# EAGLE design ups-node (EAGLE 7.2.0)
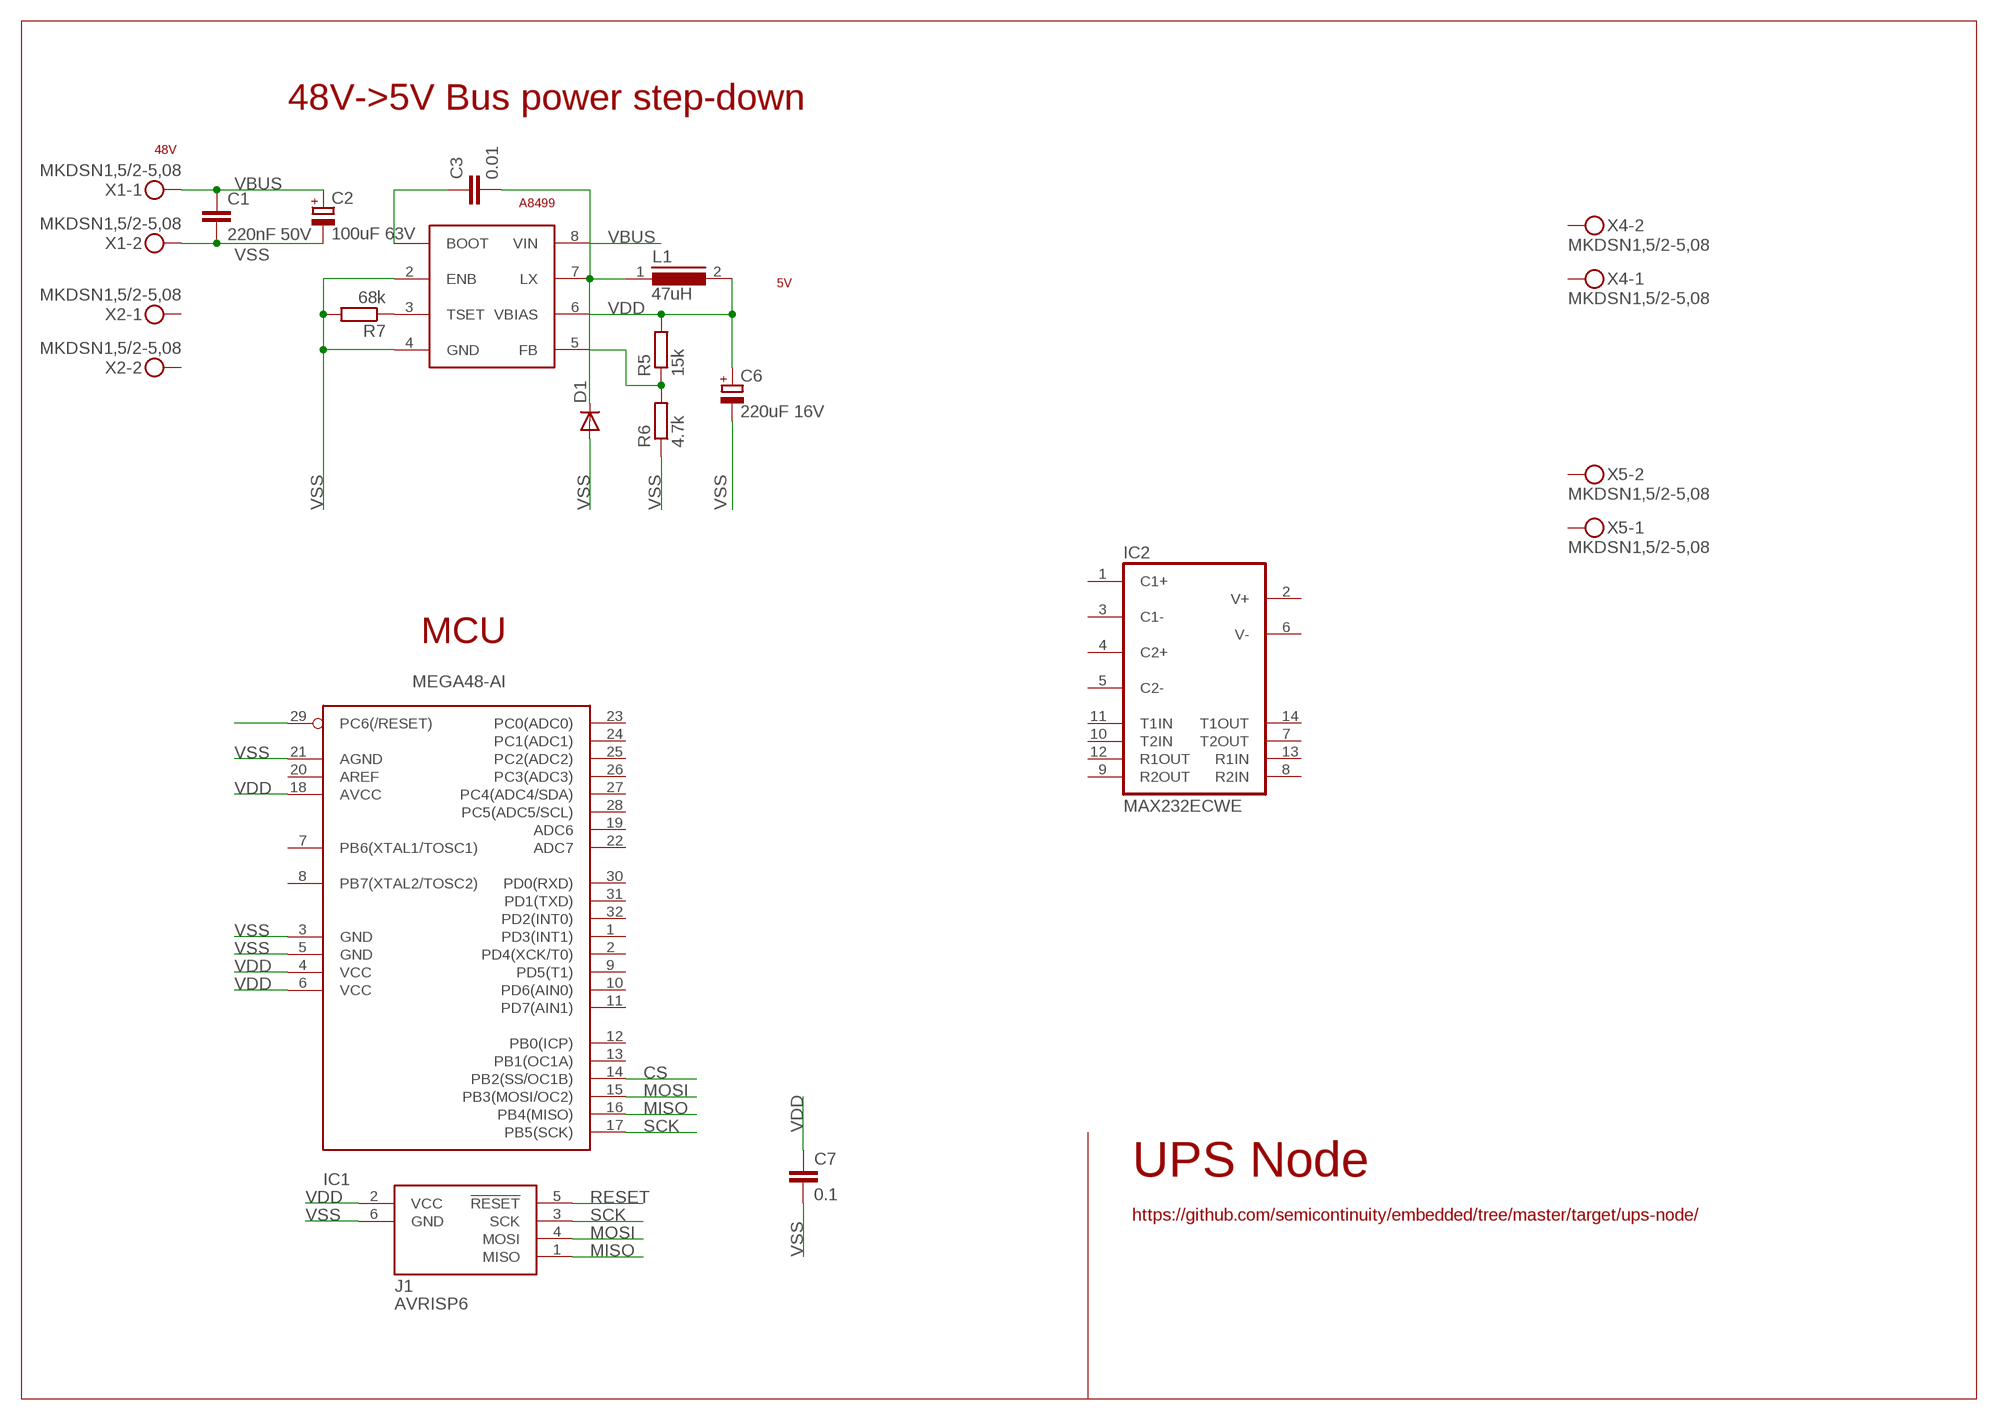
[diagram p0: schematic, sheet 1]

## Parts
C1  220nF 50V  C-EUC0805  [C0805]
C2  100uF 63V  CPOL-EU153CLV-1010  [153CLV-1010]
C3  0.01  C-EUC0805  [C0805]
C6  220uF 16V  CPOL-EU153CLV-0605  [153CLV-0605]
C7  0.1  C-EUC0805  [C0805]
D1  DIODE-SMB  [SMB]
IC1  MEGA48-AI  MEGA8-AI  [TQFP32-08]
IC2  MAX232ECWE  [SO16L]
J1  AVRISP6  [CON6P2R]
L1  47uH  DR127  [DR127]
R5  15k  R-EU_R0805  [R0805]
R6  4.7k  R-EU_R0805  [R0805]
R7  68k  R-EU_R0805  [R0805]
U$1  A8499  A8499SLJT  [SO08]
X1  MKDSN1,5/2-5,08  [MKDSN1,5/2-5,08]
X2  MKDSN1,5/2-5,08  [MKDSN1,5/2-5,08]
X4  MKDSN1,5/2-5,08  [MKDSN1,5/2-5,08]
X5  MKDSN1,5/2-5,08  [MKDSN1,5/2-5,08]

## Nets
BOOT: C3.1 U$1.1(BOOT)
CS: IC1.14(PB2(SS/OC1B))
LX: C3.2 D1.C L1.1 U$1.7(LX)
MISO: IC1.16(PB4(MISO)) J1.1(MISO)
MOSI: IC1.15(PB3(MOSI/OC2)) J1.4(MOSI)
N$14: R5.1 R6.2 U$1.5(FB)
N$15: R7.1 U$1.3(TSET)
RESET: IC1.29(PC6(/RESET)) J1.5(!RESET)
SCK: IC1.17(PB5(SCK)) J1.3(SCK)
VBUS: C1.1 C2.+ U$1.8(VIN) X1.1
VDD: C6.+ C7.1 IC1.4(VCC) IC1.6(VCC) IC1.18(AVCC) J1.2(VCC) L1.2 R5.2 U$1.6(VBIAS)
VSS: C1.2 C2.- C6.- C7.2 D1.A IC1.3(GND) IC1.5(GND) IC1.21(AGND) J1.6(GND) R6.1 R7.2 U$1.2(ENB) U$1.4(GND) X1.2
Unconnected: IC1.1(PD3(INT1)) IC1.2(PD4(XCK/T0)) IC1.7(PB6(XTAL1/TOSC1)) IC1.8(PB7(XTAL2/TOSC2)) IC1.9(PD5(T1)) IC1.10(PD6(AIN0)) IC1.11(PD7(AIN1)) IC1.12(PB0(ICP)) IC1.13(PB1(OC1A)) IC1.19(ADC6) IC1.20(AREF) IC1.22(ADC7) IC1.23(PC0(ADC0)) IC1.24(PC1(ADC1)) IC1.25(PC2(ADC2)) IC1.26(PC3(ADC3)) IC1.27(PC4(ADC4/SDA)) IC1.28(PC5(ADC5/SCL)) IC1.30(PD0(RXD)) IC1.31(PD1(TXD)) IC1.32(PD2(INT0)) IC2.1(C1+) IC2.2(V+) IC2.3(C1-) IC2.4(C2+) IC2.5(C2-) IC2.6(V-) IC2.7(T2OUT) IC2.8(R2IN) IC2.9(R2OUT) IC2.10(T2IN) IC2.11(T1IN) IC2.12(R1OUT) IC2.13(R1IN) IC2.14(T1OUT) X2.1 X2.2 X4.1 X4.2 X5.1 X5.2

## Notes on the sheet
- 48V->5V Bus power step-down
- 48V
- A8499
- 5V
- MCU
- UPS Node
- https://github.com/semicontinuity/embedded/tree/master/target/ups-node/

## Power pins joined to a net without a drawn wire
GND: IC2.15(GND)
VCC: IC2.16(VCC)

## Library data of the parts
C1 C3 C7 = rcl:C-EU: CAPACITOR, European symbol
C2 C6 = rcl:CPOL-EU: POLARIZED CAPACITOR, European symbol
D1 = diode:DIODE-: DIODE
IC1 = my-atmel:MEGA8: MICROCONTROLLER 8 Kbytes FLASH 1 kbytes SRAM 512 bytes EEPROM USART 6-channel 10 bit ADC 2-channel 8 bit ADC
IC2 = maxim:MAX232ECWE: RS232 TRANSCEIVER; MF: MAXIM; MPN: MAX232ECWE+; OC_FARNELL: 9724435; OC_NEWARK: 67K4440
J1 = ads4:AVRISP6: 6-pin dual-row connector for Atmel AVRISP programmer interface
L1 = inductors:DR127: High Power Density, High Efficiency, Shielded Inductors Source: coiltronics_dr_series.pdf
R5-R7 = rcl:R-EU_: RESISTOR, European symbol
U$1 = my-allegro:A8499SLJT: A8499SLJT Allegro Microsystems Step-Down regulator, 8V-50V, 1.5A, SO8
X1 X2 X4 X5 = con-phoenix-508:MKDSN1,5/2-5,08: MKDSN 1,5/ 2-5,08 Printklemme Nennstrom: 13,5 A Nennspannung: 250 V Rastermaß: 5,08 mm Polzahl: 2 Anschlussart: Schraubanschluss Montage: Löten Anschlussrichtung Leiter/Platine: 0 ° Artikelnummer: 1729128 Source: http://eshop.phoenixcontact.com .. 1729128.pdf; MPN: MKDSN 1,5/2-5.08; OC_FARNELL: 1792903; OC_NEWARK: 30M2397

## Board
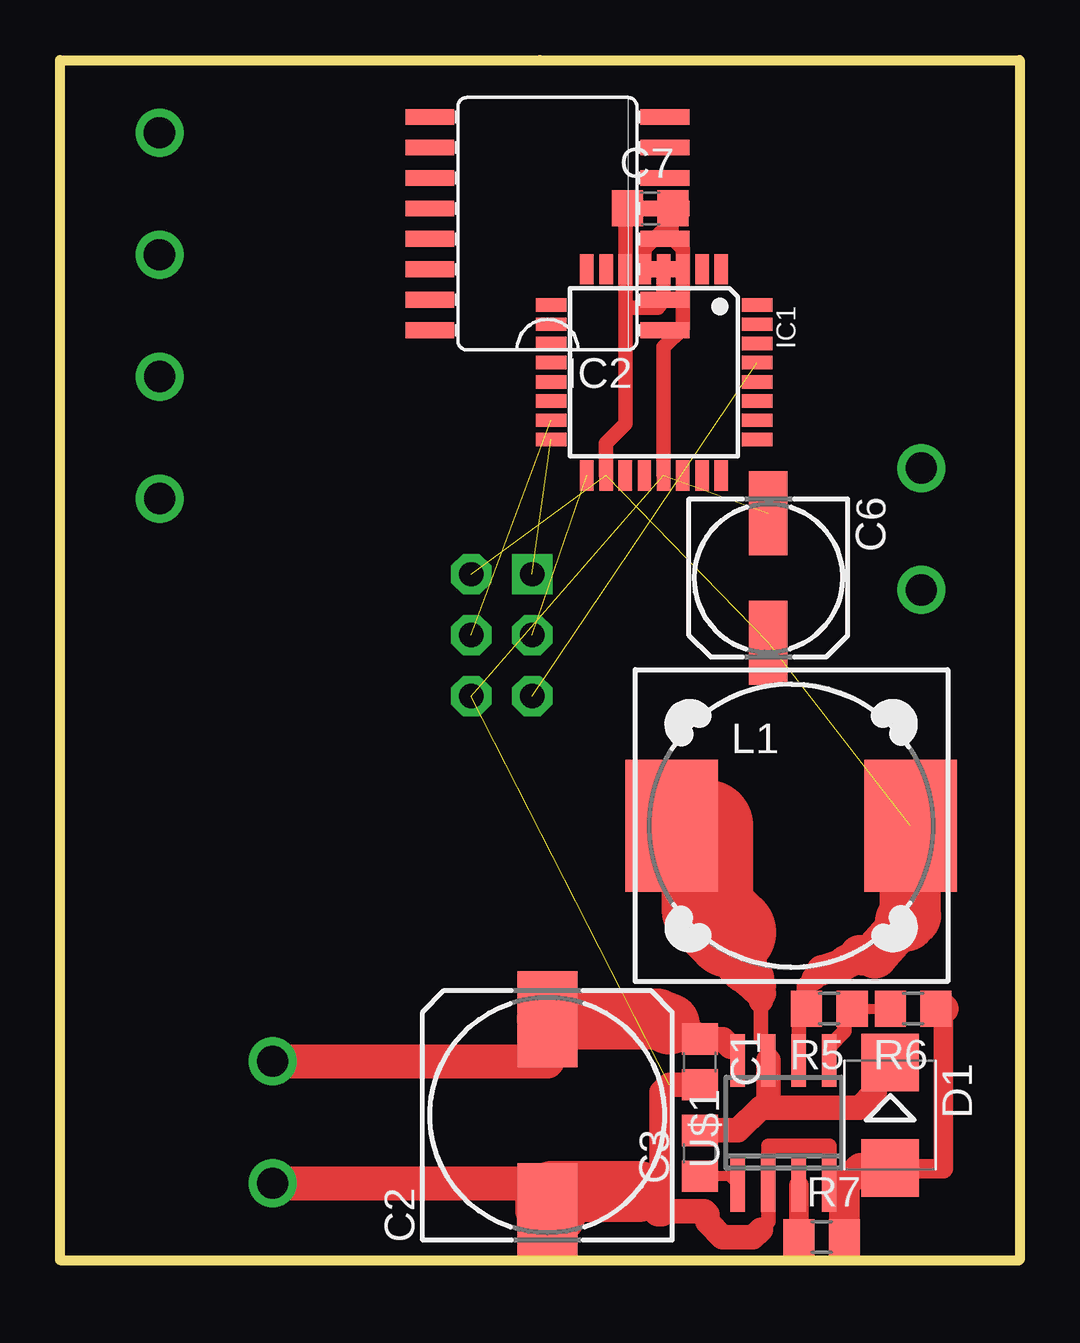
[diagram p1: board, top side]
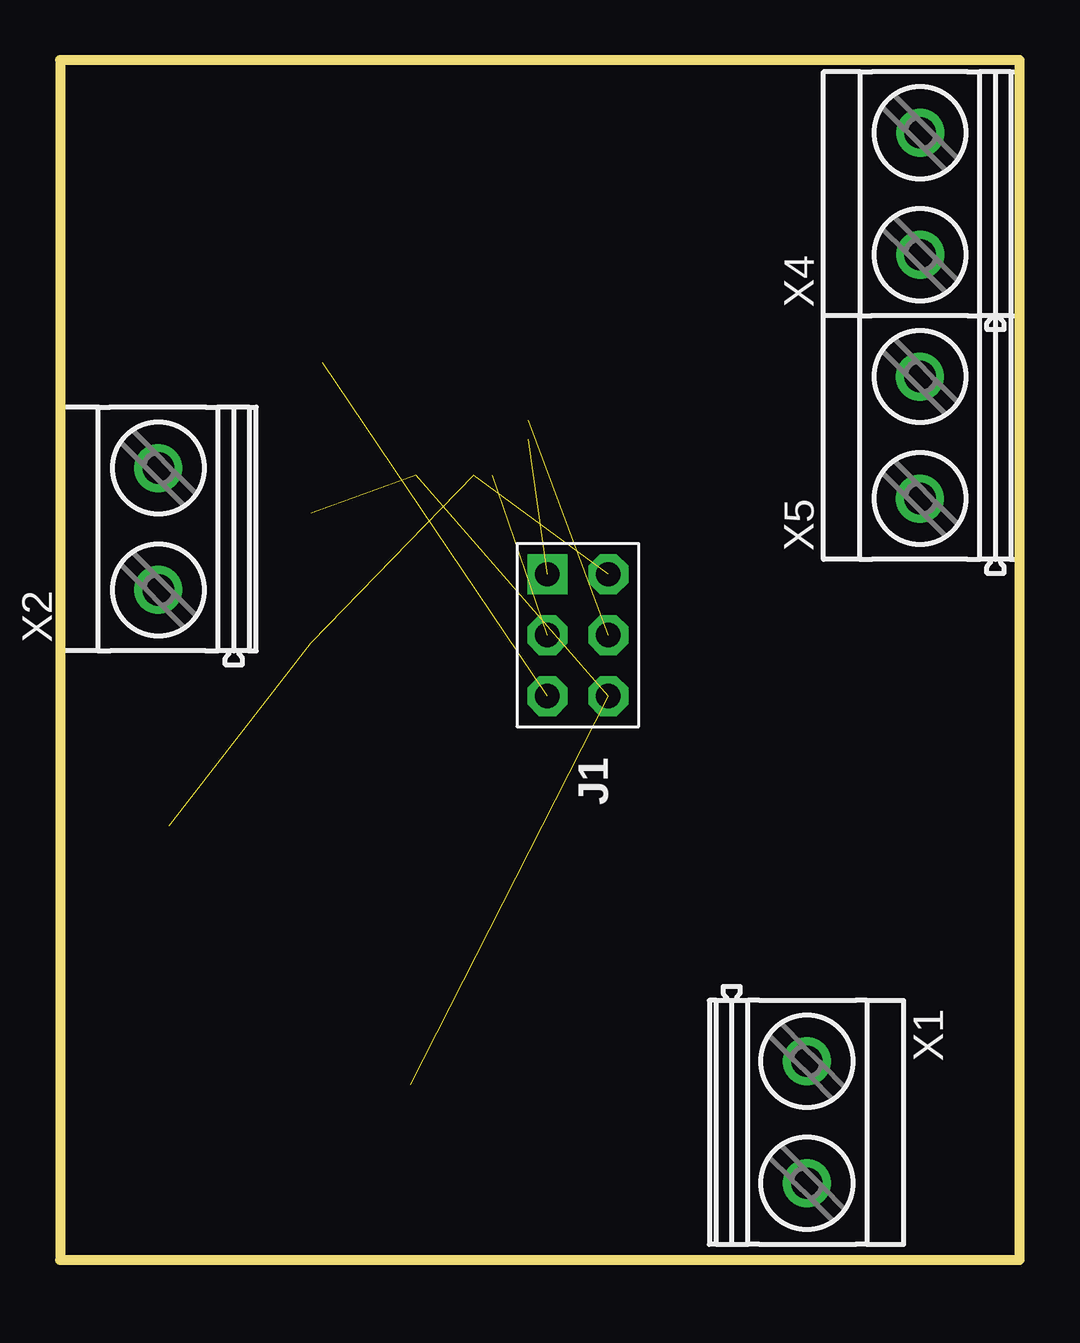
[diagram p2: board, bottom side, seen from below]

Size 40.01 x 50 mm. Coordinates in mm from the lower left corner, seen from the top.
Outline: 20,50 0,50 0,0 40.01,0
Outline: 20,50 40,50 40,0
Outline: 20,50 20,50
Copper layers (1*16): Top 0.035mm / dielectric 1.5mm / Bottom 0.035mm
Design rules "default": minimum track width 10mil, minimum drill 24mil, track to track 8mil, track to pad 8mil, pad to pad 8mil, via to via 8mil, smd to smd 8mil, copper to edge 40mil, drill to drill 8mil, minimum pad ring 10mil, minimum via ring 8mil, stop-mask expansion 4mil, vias tented up to drill 0mil, thermal gap 10mil

### Footprints (pad centres in the part's own frame; a part is rotated, then mirrored left to right if it is on the bottom)
C0805 = smd 1.3 x 1.5: 1 -0.95,0; 2 0.95,0
153CLV-1010 = smd 4 x 2.5: + 4,0; - -4,0
153CLV-0605 = smd 3.5 x 1.6: + 2.7,0; - -2.7,0
SMB = smd 2.4 x 2.4: A 2.2,0; C -2.2,0
TQFP32-08 = smd 1.27 x 0.559: 1 -4.293,2.8; 2 -4.293,2; 3 -4.293,1.2; 4 -4.293,0.4; 5 -4.293,-0.4; 6 -4.293,-1.2; 7 -4.293,-2; 8 -4.293,-2.8; 17 4.293,-2.8; 18 4.293,-2; 19 4.293,-1.2; 20 4.293,-0.4; 21 4.293,0.4; 22 4.293,1.2; 23 4.293,2; 24 4.293,2.8 | smd 0.559 x 1.27: 9 -2.8,-4.293; 10 -2,-4.293; 11 -1.2,-4.293; 12 -0.4,-4.293; 13 0.4,-4.293; 14 1.2,-4.293; 15 2,-4.293; 16 2.8,-4.293; 25 2.8,4.293; 26 2,4.293; 27 1.2,4.293; 28 0.4,4.293; 29 -0.4,4.293; 30 -1.2,4.293; 31 -2,4.293; 32 -2.8,4.293
SO16L = smd 0.66 x 2.032: 1 -4.445,-4.902; 2 -3.175,-4.902; 3 -1.905,-4.902; 4 -0.635,-4.902; 5 0.635,-4.902; 6 1.905,-4.902; 7 3.175,-4.902; 8 4.445,-4.902; 9 4.445,4.902; 10 3.175,4.902; 11 1.905,4.902; 12 0.635,4.902; 13 -0.635,4.902; 14 -1.905,4.902; 15 -3.175,4.902; 16 -4.445,4.902
CON6P2R = drill 1.016 pad 1.676 square: 1 -2.54,-1.27 | drill 1.016 pad 1.676 octagon: 2 -2.54,1.27; 3 0,-1.27; 4 0,1.27; 5 2.54,-1.27; 6 2.54,1.27
DR127 = smd 3.85 x 5.5: 1 -4.975,0; 2 4.975,0
R0805 = smd 1.3 x 1.5: 1 -0.95,0; 2 0.95,0
SO08 = smd 0.6 x 2.2: 1 -1.905,-2.6; 2 -0.635,-2.6; 3 0.635,-2.6; 4 1.905,-2.6; 5 1.905,2.6; 6 0.635,2.6; 7 -0.635,2.6; 8 -1.905,2.6
MKDSN1,5/2-5,08 = drill 1.3 pad 2: 1 -2.561,0.025; 2 2.519,0.025

### Placement (x,y rotation side)
C1  26.67,8.26 270 top
C2  20.32,6.03 90 top
C3  26.67,4.45 90 top
C6  29.53,28.42 270 top
C7  24.61,43.81 0 top
D1  34.61,6.03 270 top
IC1  24.77,36.99 270 top
IC2  20.32,43.18 90 top
J1  18.41,26.04 270 bottom
L1  30.48,18.1 0 top
R5  32.07,10.48 180 top
R6  35.56,10.48 180 top
R7  31.75,0.95 0 top
U$1  30.16,5.71 0 top
X1  8.89,5.71 270 bottom
X2  35.88,30.48 90 bottom
X4  4.12,44.45 90 bottom
X5  4.13,34.29 90 bottom

### Tracks (layer width: path | path; a pad name or v marks a point on that pad's centre or on a via)
BOOT
  Top 0.406: U$1.1 27.88,3.5 C3.1
LX
  Top 0.406: 34.59,8.23 D1.C 35.22,8.23 35.24,8.26
  Top 0.61: U$1.7 29.53,8.89 29.21,9.21 29.21,10.79
  Top 1.016: 29.21,10.79 29.21,11.11 | 34.59,8.23 33.97,7.62 33.97,6.99 33.34,6.35 29.53,6.35 | 29.53,6.35 U$1.7 | C3.2 28.26,5.4 29.21,6.35 29.53,6.35
  Top 1.27: 29.21,11.11 28.89,11.43 29.21,11.43 28.89,11.75
  Top 1.778: 28.89,11.75 28.57,12.06
  Top 1.93: 28.57,12.06 28.26,12.38 28.26,12.7
  Top 2.184: 28.26,12.7 27.94,13.02 27.94,13.65
  Top 3.81: 27.94,13.65 26.99,14.61 26.99,18.1 L1.1
MISO  (1 unrouted)
MOSI  (1 unrouted)
N$14
  Top 0.406: R5.1 R6.2
  Top 0.61: R5.1 32.7,10.16 32.7,9.53 32.07,8.89 U$1.5
N$15
  Top 0.406: R7.1
  Top 0.813: U$1.3 R7.1
RESET  (1 unrouted)
SCK  (1 unrouted)
VBUS
  Top 0.61: U$1.8 28.26,8.57 27.94,8.89
  Top 1.016: 21.08,10.79 C2.+ | 27.94,8.89 27.62,9.21 C1.1
  Top 1.27: C1.1 25.4,9.84
  Top 1.422: X1.1 20.32,8.28 C2.+
  Top 2.54: 25.4,9.84 24.89,10.03 C2.+
VDD  (3 unrouted)
  Top 0.406: 30.8,10.47 R5.2 31.11,10.79 | 35.45,16.09 L1.2
  Top 0.61: 30.8,10.47 U$1.6 | 23.57,39.85 IC1.6 23.57,43.72 C7.1 | 23.57,39.85 23.57,34.84 22.77,34.04 IC1.18 | 23.57,39.85 23.72,39.69 24.92,39.69 25.16,39.93 IC1.4
  Top 0.813: 31.11,10.79 31.11,11.43 31.43,11.75
  Top 1.016: 31.43,11.75 31.75,12.06
  Top 1.27: 31.75,12.06 32.7,12.38
  Top 1.422: 32.7,12.38 33.34,12.7
  Top 1.676: 33.34,12.7 33.97,12.7
  Top 1.93: 33.97,12.7 35.24,14.13
  Top 2.54: 35.24,14.13 35.45,14.34 L1.2
VSS  (3 unrouted)
  Top 0.406: R7.2 | 32.07,3.17 U$1.4 | 19.68,2.03 C2.-
  Top 0.61: 29.21,1.27 29.53,1.59 U$1.2 29.53,4.76 32.07,4.76 U$1.4 32.64,3.12 32.7,3.17 | IC1.21 25.16,38.02 25.96,38.82 IC1.3 25.96,42.14 25.48,42.62 25.48,43.26 | IC1.5 24.36,42.15 25.48,43.26 | 25.48,43.26 25.56,43.34 C7.2
  Top 0.813: 36.83,10.48 36.83,3.81 34.61,3.81 | C2.- 20.32,1.59
  Top 1.016: C1.2 25.4,7.3 25.08,6.99 25.08,2.03 26.86,2.03 26.99,1.91 26.99,1.59 27.62,0.95 28.89,0.95 29.21,1.27
  Top 1.27: 24.13,2.86 24.95,2.03 25.08,2.03 | R7.2 32.7,3.17 33.36,3.83 D1.A 34.61,3.81 | R6.1 36.83,10.48
  Top 1.422: X1.2 20.32,3.2 20.32,2.54 19.68,2.54 19.68,2.03
  Top 2.54: 20.51,2.86 20.64,2.86 | 20.64,2.86 24.13,2.86 | 20.32,1.59 20.64,1.91 20.64,2.86
  pour Top (isolate 0.61): 40.01,0.16 40.01,25.88 40.01,49.85